# EAGLE design untitled (EAGLE 6.4)
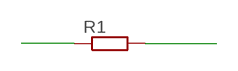
[diagram p0: schematic, sheet 1]

## Parts
R1  R-EU_R0603  [R0603]

## Nets
GND: R1.2
VDD: R1.1

## Library data of the parts
R1 = rcl:R-EU_: RESISTOR, European symbol

## Board
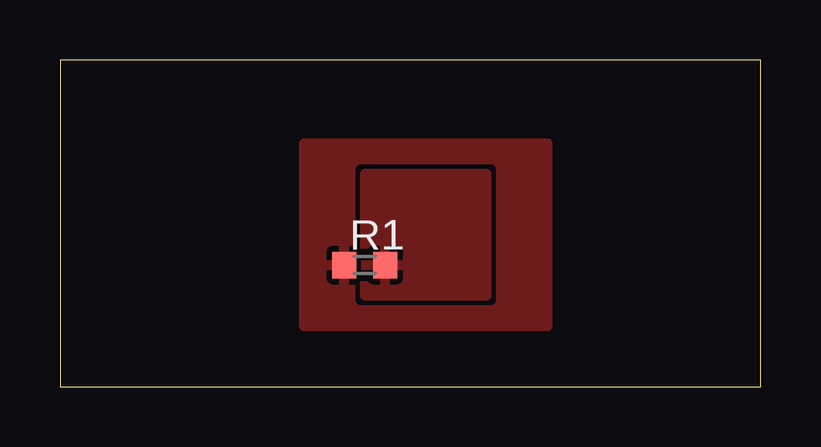
[diagram p1: board, top side]
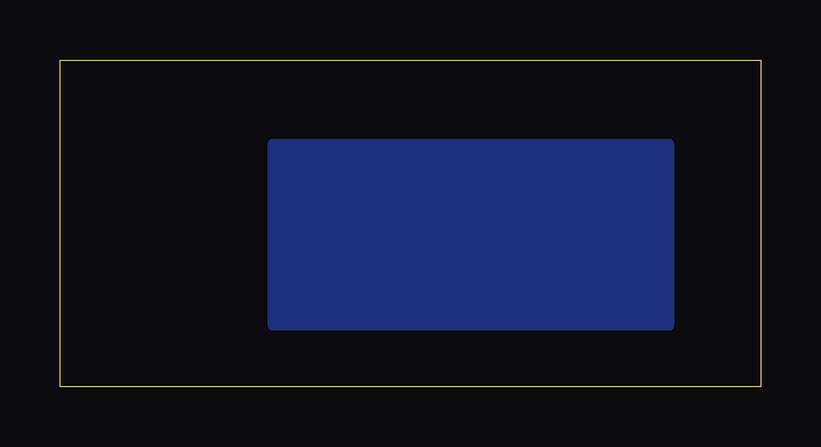
[diagram p2: board, bottom side, seen from below]

Size 29.19 x 13.64 mm. Coordinates in mm from the lower left corner, seen from the top.
Outline: 0,0 29.19,0 29.19,13.64 0,13.64 0,0
Copper layers (1*16): Top 0.035mm / dielectric 1.5mm / Bottom 0.035mm
Design rules "default": minimum track width 10mil, minimum drill 24mil, track to track 8mil, track to pad 8mil, pad to pad 8mil, via to via 8mil, smd to smd 8mil, copper to edge 40mil, drill to drill 8mil, minimum pad ring 10mil, minimum via ring 8mil, stop-mask expansion 4mil, vias tented up to drill 0mil, thermal gap 10mil

### Footprints (pad centres in the part's own frame; a part is rotated, then mirrored left to right if it is on the bottom)
R0603 = smd 1 x 1.1: 1 -0.85,0; 2 0.85,0

### Placement (x,y rotation side)
R1  12.7,5.08 0 top

### Tracks (layer width: path | path; a pad name or v marks a point on that pad's centre or on a via)
GND
  pour Bottom: 3.81,8.89 3.81,2.54 20.32,2.54 20.32,10.16 3.81,10.16
  pour Top: 12.7,8.89 12.7,3.81 17.78,3.81 17.78,8.89
VDD
  pour Top (rank 2): 10.16,10.16 10.16,2.54 20.32,2.54 20.32,10.16